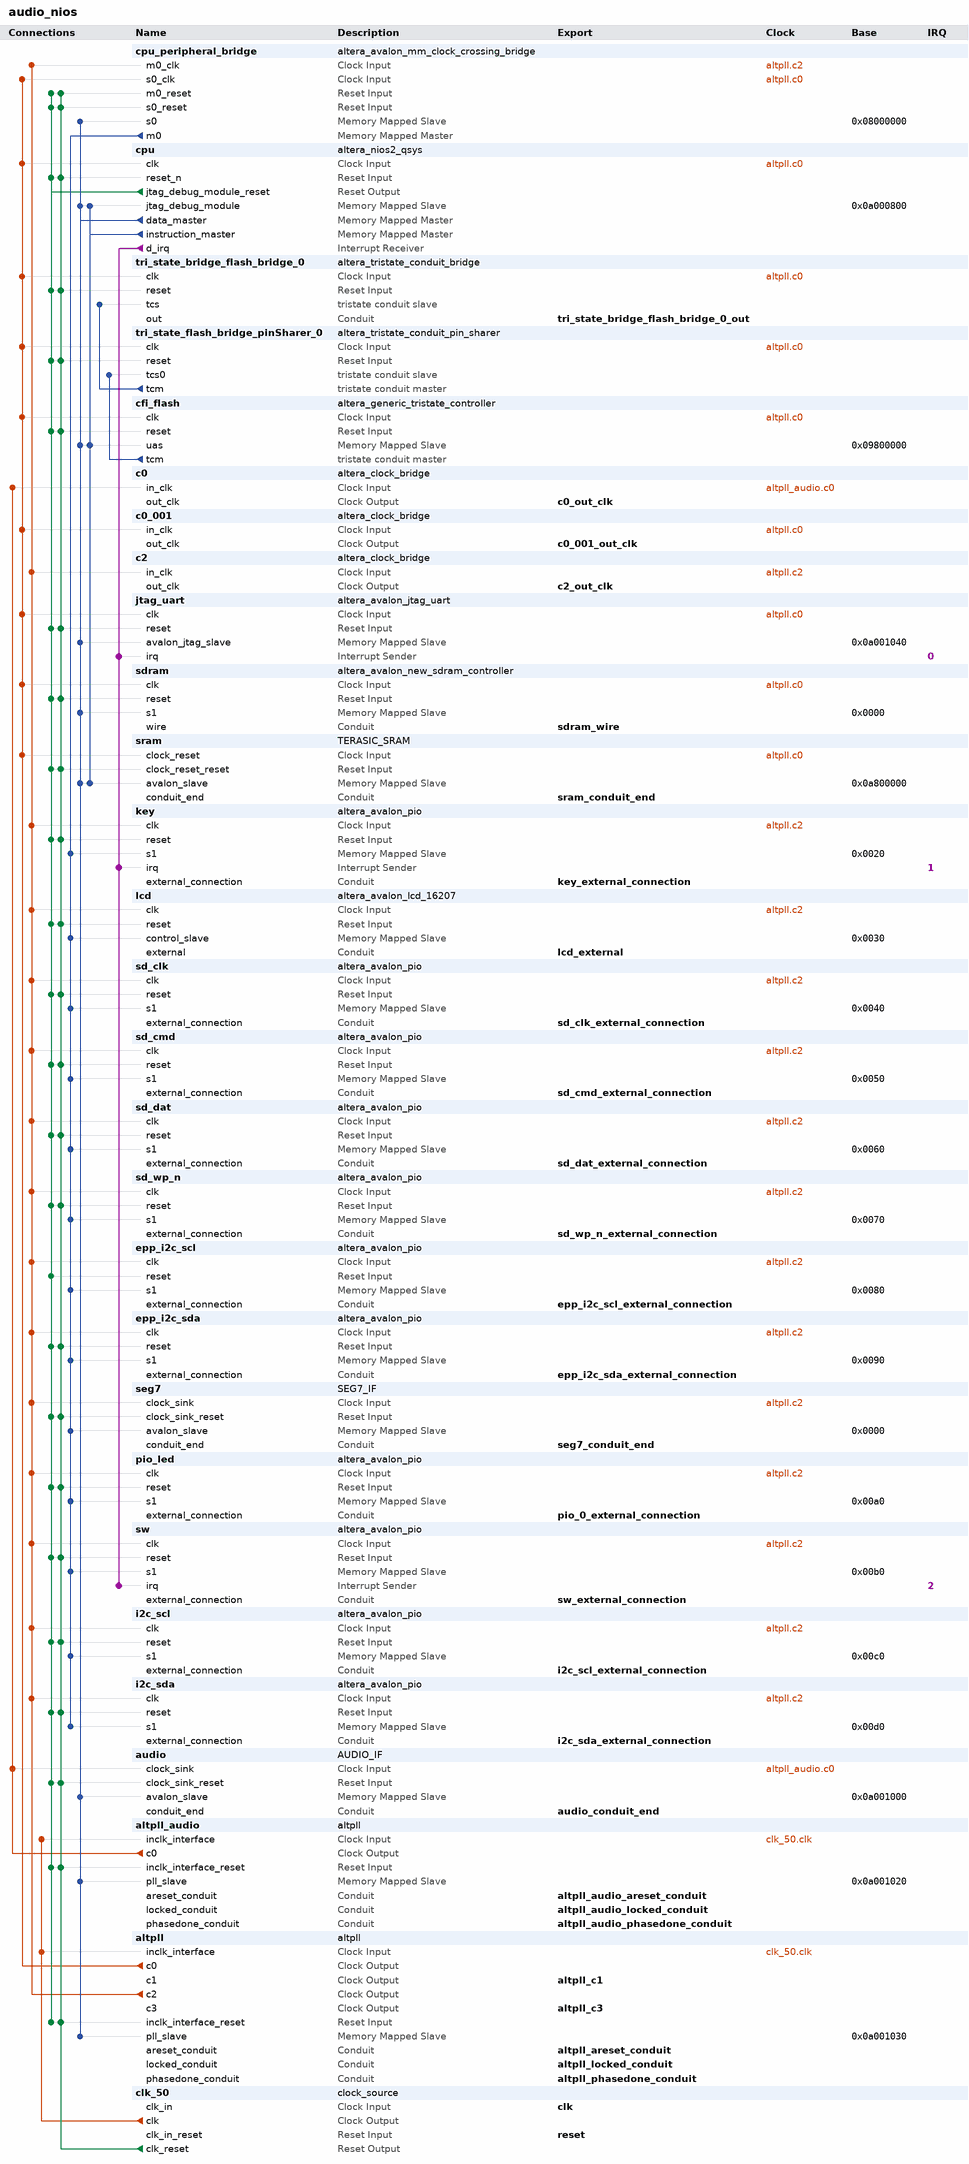
[diagram p0: system contents]
# Platform Designer (Qsys) system audio_nios, Cyclone IV E EP4CE115F29C7
# Parameters at their usual value, and those the tool derives, are not listed.
package require -exact qsys 12.0
create_system audio_nios
set_project_property DEVICE_FAMILY {Cyclone IV E}
set_project_property DEVICE EP4CE115F29C7

add_instance cpu_peripheral_bridge altera_avalon_mm_clock_crossing_bridge 12.0
set_instance_parameter_value cpu_peripheral_bridge DATA_WIDTH 32
set_instance_parameter_value cpu_peripheral_bridge ADDRESS_WIDTH 9
set_instance_parameter_value cpu_peripheral_bridge MAX_BURST_SIZE 1
set_instance_parameter_value cpu_peripheral_bridge COMMAND_FIFO_DEPTH 32
set_instance_parameter_value cpu_peripheral_bridge RESPONSE_FIFO_DEPTH 64
set_instance_parameter_value cpu_peripheral_bridge MASTER_SYNC_DEPTH 3
set_instance_parameter_value cpu_peripheral_bridge SLAVE_SYNC_DEPTH 3

add_instance cpu altera_nios2_qsys 12.0
set_instance_parameter_value cpu resetSlave sram.avalon_slave
set_instance_parameter_value cpu exceptionSlave sram.avalon_slave
set_instance_parameter_value cpu breakSlave cpu.jtag_debug_module
set_instance_parameter_value cpu impl Fast
set_instance_parameter_value cpu icache_size 4096

add_instance tri_state_bridge_flash_bridge_0 altera_tristate_conduit_bridge 12.0

add_instance tri_state_flash_bridge_pinSharer_0 altera_tristate_conduit_pin_sharer 12.0
set_instance_parameter_value tri_state_flash_bridge_pinSharer_0 NUM_INTERFACES 1
set_instance_parameter_value tri_state_flash_bridge_pinSharer_0 MODULE_ORIGIN_LIST cfi_flash.tcm,cfi_flash.tcm,cfi_flash.tcm,cfi_flash.tcm,cfi_flash.tcm
set_instance_parameter_value tri_state_flash_bridge_pinSharer_0 SHARED_SIGNAL_LIST address_to_the_cfi_flash,read_n_to_the_cfi_flash,write_n_to_the_cfi_flash,tri_state_bridge_flash_data,select_n_to_the_cfi_flash

add_instance cfi_flash altera_generic_tristate_controller 12.0
set_instance_parameter_value cfi_flash TCM_ADDRESS_W 23
set_instance_parameter_value cfi_flash TCM_DATA_W 8
set_instance_parameter_value cfi_flash TCM_BYTEENABLE_W 1
set_instance_parameter_value cfi_flash TCM_READ_WAIT 0
set_instance_parameter_value cfi_flash TCM_WRITE_WAIT 0
set_instance_parameter_value cfi_flash TCM_SETUP_WAIT 0
set_instance_parameter_value cfi_flash TCM_DATA_HOLD 0
set_instance_parameter_value cfi_flash TCM_MAX_PENDING_READ_TRANSACTIONS 3
set_instance_parameter_value cfi_flash TCM_TURNAROUND_TIME 2
set_instance_parameter_value cfi_flash TCM_TIMING_UNITS 0
set_instance_parameter_value cfi_flash TCM_READLATENCY 2
set_instance_parameter_value cfi_flash TCM_SYMBOLS_PER_WORD 1
set_instance_parameter_value cfi_flash USE_READ 1
set_instance_parameter_value cfi_flash USE_BEGINTRANSFER 0
set_instance_parameter_value cfi_flash USE_BYTEENABLE 0
set_instance_parameter_value cfi_flash USE_OUTPUTENABLE 0
set_instance_parameter_value cfi_flash ACTIVE_LOW_READ 1
set_instance_parameter_value cfi_flash ACTIVE_LOW_BYTEENABLE 0
set_instance_parameter_value cfi_flash ACTIVE_LOW_OUTPUTENABLE 0
set_instance_parameter_value cfi_flash ACTIVE_LOW_BEGINTRANSFER 0
set_instance_parameter_value cfi_flash CHIPSELECT_THROUGH_READLATENCY 0
set_instance_parameter_value cfi_flash MODULE_ASSIGNMENT_KEYS embeddedsw.configuration.hwClassnameDriverSupportList,embeddedsw.configuration.hwClassnameDriverSupportDefault,embeddedsw.CMacro.SETUP_VALUE,embeddedsw.CMacro.WAIT_VALUE,embeddedsw.CMacro.HOLD_VALUE,embeddedsw.CMacro.TIMING_UNITS,embeddedsw.CMacro.SIZE,embeddedsw.memoryInfo.MEM_INIT_DATA_WIDTH,embeddedsw.memoryInfo.HAS_BYTE_LANE,embeddedsw.memoryInfo.IS_FLASH,embeddedsw.memoryInfo.GENERATE_DAT_SYM,embeddedsw.memoryInfo.GENERATE_FLASH,embeddedsw.memoryInfo.DAT_SYM_INSTALL_DIR,embeddedsw.memoryInfo.FLASH_INSTALL_DIR
set_instance_parameter_value cfi_flash MODULE_ASSIGNMENT_VALUES altera_avalon_lan91c111:altera_avalon_cfi_flash,altera_avalon_cfi_flash,60,160,60,ns,8388608u,8,0,1,1,1,SIM_DIR,APP_DIR
set_instance_parameter_value cfi_flash INTERFACE_ASSIGNMENT_KEYS embeddedsw.configuration.isFlash,embeddedsw.configuration.isMemoryDevice,embeddedsw.configuration.isNonVolatileStorage
set_instance_parameter_value cfi_flash INTERFACE_ASSIGNMENT_VALUES 1,1,1

add_instance c0 altera_clock_bridge 12.0
set_instance_parameter_value c0 DERIVED_CLOCK_RATE 18431999
set_instance_parameter_value c0 EXPLICIT_CLOCK_RATE 0

add_instance c0_001 altera_clock_bridge 12.0
set_instance_parameter_value c0_001 DERIVED_CLOCK_RATE 100000000
set_instance_parameter_value c0_001 EXPLICIT_CLOCK_RATE 0

add_instance c2 altera_clock_bridge 12.0
set_instance_parameter_value c2 DERIVED_CLOCK_RATE 10000000
set_instance_parameter_value c2 EXPLICIT_CLOCK_RATE 0

add_instance jtag_uart altera_avalon_jtag_uart 12.0
set_instance_parameter_value jtag_uart simInteractiveOptions INTERACTIVE_ASCII_OUTPUT

add_instance sdram altera_avalon_new_sdram_controller 12.0
set_instance_parameter_value sdram TAC 6.0
set_instance_parameter_value sdram TRCD 20.0
set_instance_parameter_value sdram TRP 20.0
set_instance_parameter_value sdram casLatency 3
set_instance_parameter_value sdram columnWidth 10
set_instance_parameter_value sdram dataWidth 32
set_instance_parameter_value sdram generateSimulationModel true
set_instance_parameter_value sdram model custom
set_instance_parameter_value sdram numberOfBanks 4
set_instance_parameter_value sdram numberOfChipSelects 1
set_instance_parameter_value sdram powerUpDelay 100.0
set_instance_parameter_value sdram refreshPeriod 15.625
set_instance_parameter_value sdram rowWidth 13

add_instance sram TERASIC_SRAM 1.0
set_instance_parameter_value sram DATA_BITS 16
set_instance_parameter_value sram ADDR_BITS 20

add_instance key altera_avalon_pio 12.0
set_instance_parameter_value key captureEdge true
set_instance_parameter_value key direction Input
set_instance_parameter_value key edgeType FALLING
set_instance_parameter_value key generateIRQ true
set_instance_parameter_value key irqType EDGE
set_instance_parameter_value key width 4

add_instance lcd altera_avalon_lcd_16207 12.0

add_instance sd_clk altera_avalon_pio 12.0
set_instance_parameter_value sd_clk direction Output
set_instance_parameter_value sd_clk width 1

add_instance sd_cmd altera_avalon_pio 12.0
set_instance_parameter_value sd_cmd direction Bidir
set_instance_parameter_value sd_cmd width 1

add_instance sd_dat altera_avalon_pio 12.0
set_instance_parameter_value sd_dat direction Bidir
set_instance_parameter_value sd_dat width 4

add_instance sd_wp_n altera_avalon_pio 12.0
set_instance_parameter_value sd_wp_n direction Input
set_instance_parameter_value sd_wp_n width 1

add_instance epp_i2c_scl altera_avalon_pio 12.0
set_instance_parameter_value epp_i2c_scl direction Output
set_instance_parameter_value epp_i2c_scl width 1

add_instance epp_i2c_sda altera_avalon_pio 12.0
set_instance_parameter_value epp_i2c_sda direction Bidir
set_instance_parameter_value epp_i2c_sda width 1

add_instance seg7 SEG7_IF 1.0
set_instance_parameter_value seg7 SEG7_NUM 8

add_instance pio_led altera_avalon_pio 12.0
set_instance_parameter_value pio_led direction Output
set_instance_parameter_value pio_led width 26

add_instance sw altera_avalon_pio 12.0
set_instance_parameter_value sw captureEdge true
set_instance_parameter_value sw direction Input
set_instance_parameter_value sw edgeType FALLING
set_instance_parameter_value sw generateIRQ true
set_instance_parameter_value sw irqType EDGE
set_instance_parameter_value sw width 18

add_instance i2c_scl altera_avalon_pio 12.0
set_instance_parameter_value i2c_scl direction Output
set_instance_parameter_value i2c_scl width 1

add_instance i2c_sda altera_avalon_pio 12.0
set_instance_parameter_value i2c_sda direction Bidir
set_instance_parameter_value i2c_sda width 1

add_instance audio AUDIO_IF 1.0

add_instance altpll_audio altpll 12.0
set_instance_parameter_value altpll_audio INCLK0_INPUT_FREQUENCY 20000
set_instance_parameter_value altpll_audio CLK0_MULTIPLY_BY 1152
set_instance_parameter_value altpll_audio CLK0_DIVIDE_BY 3125
set_instance_parameter_value altpll_audio PORT_clk1 PORT_UNUSED
set_instance_parameter_value altpll_audio PORT_clk2 PORT_UNUSED
set_instance_parameter_value altpll_audio PORT_clk3 PORT_UNUSED
set_instance_parameter_value altpll_audio PORT_ARESET PORT_UNUSED
set_instance_parameter_value altpll_audio PORT_LOCKED PORT_UNUSED

add_instance altpll altpll 12.0
set_instance_parameter_value altpll INCLK0_INPUT_FREQUENCY 20000
set_instance_parameter_value altpll CLK0_MULTIPLY_BY 2
set_instance_parameter_value altpll CLK1_MULTIPLY_BY 2
set_instance_parameter_value altpll CLK2_MULTIPLY_BY 1
set_instance_parameter_value altpll CLK3_MULTIPLY_BY 1
set_instance_parameter_value altpll CLK0_DIVIDE_BY 1
set_instance_parameter_value altpll CLK1_DIVIDE_BY 1
set_instance_parameter_value altpll CLK2_DIVIDE_BY 5
set_instance_parameter_value altpll CLK3_DIVIDE_BY 2
set_instance_parameter_value altpll CLK1_PHASE_SHIFT -1806
set_instance_parameter_value altpll CLK2_PHASE_SHIFT 0
set_instance_parameter_value altpll CLK3_PHASE_SHIFT 0
set_instance_parameter_value altpll CLK1_DUTY_CYCLE 50
set_instance_parameter_value altpll CLK2_DUTY_CYCLE 50
set_instance_parameter_value altpll CLK3_DUTY_CYCLE 50
set_instance_parameter_value altpll PORT_clk1 PORT_USED
set_instance_parameter_value altpll PORT_clk2 PORT_USED
set_instance_parameter_value altpll PORT_clk3 PORT_USED
set_instance_parameter_value altpll PORT_ARESET PORT_UNUSED
set_instance_parameter_value altpll PORT_LOCKED PORT_UNUSED

add_instance clk_50 clock_source 12.0
set_instance_parameter_value clk_50 clockFrequency 50000000

# connections
add_connection altpll.c0 c0_001.in_clk clock
add_connection altpll.c0 cfi_flash.clk clock
add_connection altpll.c0 cpu.clk clock
add_connection altpll.c0 cpu_peripheral_bridge.s0_clk clock
add_connection altpll.c0 jtag_uart.clk clock
add_connection altpll.c0 sdram.clk clock
add_connection altpll.c0 sram.clock_reset clock
add_connection altpll.c0 tri_state_bridge_flash_bridge_0.clk clock
add_connection altpll.c0 tri_state_flash_bridge_pinSharer_0.clk clock
add_connection altpll.c2 c2.in_clk clock
add_connection altpll.c2 cpu_peripheral_bridge.m0_clk clock
add_connection altpll.c2 epp_i2c_scl.clk clock
add_connection altpll.c2 epp_i2c_sda.clk clock
add_connection altpll.c2 i2c_scl.clk clock
add_connection altpll.c2 i2c_sda.clk clock
add_connection altpll.c2 key.clk clock
add_connection altpll.c2 lcd.clk clock
add_connection altpll.c2 pio_led.clk clock
add_connection altpll.c2 sd_clk.clk clock
add_connection altpll.c2 sd_cmd.clk clock
add_connection altpll.c2 sd_dat.clk clock
add_connection altpll.c2 sd_wp_n.clk clock
add_connection altpll.c2 seg7.clock_sink clock
add_connection altpll.c2 sw.clk clock
add_connection altpll_audio.c0 audio.clock_sink clock
add_connection altpll_audio.c0 c0.in_clk clock
add_connection clk_50.clk altpll.inclk_interface clock
add_connection clk_50.clk altpll_audio.inclk_interface clock
add_connection clk_50.clk_reset altpll.inclk_interface_reset reset
add_connection clk_50.clk_reset altpll_audio.inclk_interface_reset reset
add_connection clk_50.clk_reset audio.clock_sink_reset reset
add_connection clk_50.clk_reset cfi_flash.reset reset
add_connection clk_50.clk_reset cpu.reset_n reset
add_connection clk_50.clk_reset cpu_peripheral_bridge.m0_reset reset
add_connection clk_50.clk_reset cpu_peripheral_bridge.s0_reset reset
add_connection clk_50.clk_reset epp_i2c_sda.reset reset
add_connection clk_50.clk_reset i2c_scl.reset reset
add_connection clk_50.clk_reset i2c_sda.reset reset
add_connection clk_50.clk_reset jtag_uart.reset reset
add_connection clk_50.clk_reset key.reset reset
add_connection clk_50.clk_reset lcd.reset reset
add_connection clk_50.clk_reset pio_led.reset reset
add_connection clk_50.clk_reset sd_clk.reset reset
add_connection clk_50.clk_reset sd_cmd.reset reset
add_connection clk_50.clk_reset sd_dat.reset reset
add_connection clk_50.clk_reset sd_wp_n.reset reset
add_connection clk_50.clk_reset sdram.reset reset
add_connection clk_50.clk_reset seg7.clock_sink_reset reset
add_connection clk_50.clk_reset sram.clock_reset_reset reset
add_connection clk_50.clk_reset sw.reset reset
add_connection clk_50.clk_reset tri_state_bridge_flash_bridge_0.reset reset
add_connection clk_50.clk_reset tri_state_flash_bridge_pinSharer_0.reset reset
add_connection cpu.jtag_debug_module_reset altpll.inclk_interface_reset reset
add_connection cpu.jtag_debug_module_reset altpll_audio.inclk_interface_reset reset
add_connection cpu.jtag_debug_module_reset audio.clock_sink_reset reset
add_connection cpu.jtag_debug_module_reset cfi_flash.reset reset
add_connection cpu.jtag_debug_module_reset cpu.reset_n reset
add_connection cpu.jtag_debug_module_reset cpu_peripheral_bridge.m0_reset reset
add_connection cpu.jtag_debug_module_reset cpu_peripheral_bridge.s0_reset reset
add_connection cpu.jtag_debug_module_reset epp_i2c_scl.reset reset
add_connection cpu.jtag_debug_module_reset epp_i2c_sda.reset reset
add_connection cpu.jtag_debug_module_reset i2c_scl.reset reset
add_connection cpu.jtag_debug_module_reset i2c_sda.reset reset
add_connection cpu.jtag_debug_module_reset jtag_uart.reset reset
add_connection cpu.jtag_debug_module_reset key.reset reset
add_connection cpu.jtag_debug_module_reset lcd.reset reset
add_connection cpu.jtag_debug_module_reset pio_led.reset reset
add_connection cpu.jtag_debug_module_reset sd_clk.reset reset
add_connection cpu.jtag_debug_module_reset sd_cmd.reset reset
add_connection cpu.jtag_debug_module_reset sd_dat.reset reset
add_connection cpu.jtag_debug_module_reset sd_wp_n.reset reset
add_connection cpu.jtag_debug_module_reset sdram.reset reset
add_connection cpu.jtag_debug_module_reset seg7.clock_sink_reset reset
add_connection cpu.jtag_debug_module_reset sram.clock_reset_reset reset
add_connection cpu.jtag_debug_module_reset sw.reset reset
add_connection cpu.jtag_debug_module_reset tri_state_bridge_flash_bridge_0.reset reset
add_connection cpu.jtag_debug_module_reset tri_state_flash_bridge_pinSharer_0.reset reset
add_connection cpu.data_master altpll.pll_slave avalon
set_connection_parameter_value cpu.data_master/altpll.pll_slave baseAddress 0x0a001030
add_connection cpu.data_master altpll_audio.pll_slave avalon
set_connection_parameter_value cpu.data_master/altpll_audio.pll_slave baseAddress 0x0a001020
add_connection cpu.data_master audio.avalon_slave avalon
set_connection_parameter_value cpu.data_master/audio.avalon_slave baseAddress 0x0a001000
add_connection cpu.data_master cfi_flash.uas avalon
set_connection_parameter_value cpu.data_master/cfi_flash.uas baseAddress 0x09800000
add_connection cpu.data_master cpu.jtag_debug_module avalon
set_connection_parameter_value cpu.data_master/cpu.jtag_debug_module baseAddress 0x0a000800
add_connection cpu.data_master cpu_peripheral_bridge.s0 avalon
set_connection_parameter_value cpu.data_master/cpu_peripheral_bridge.s0 baseAddress 0x08000000
add_connection cpu.data_master jtag_uart.avalon_jtag_slave avalon
set_connection_parameter_value cpu.data_master/jtag_uart.avalon_jtag_slave baseAddress 0x0a001040
add_connection cpu.data_master sdram.s1 avalon
set_connection_parameter_value cpu.data_master/sdram.s1 baseAddress 0x0000
add_connection cpu.data_master sram.avalon_slave avalon
set_connection_parameter_value cpu.data_master/sram.avalon_slave baseAddress 0x0a800000
add_connection cpu.instruction_master cfi_flash.uas avalon
set_connection_parameter_value cpu.instruction_master/cfi_flash.uas baseAddress 0x09800000
add_connection cpu.instruction_master cpu.jtag_debug_module avalon
set_connection_parameter_value cpu.instruction_master/cpu.jtag_debug_module baseAddress 0x0a000800
add_connection cpu.instruction_master sram.avalon_slave avalon
set_connection_parameter_value cpu.instruction_master/sram.avalon_slave baseAddress 0x0a800000
add_connection cpu_peripheral_bridge.m0 epp_i2c_scl.s1 avalon
set_connection_parameter_value cpu_peripheral_bridge.m0/epp_i2c_scl.s1 baseAddress 0x0080
add_connection cpu_peripheral_bridge.m0 epp_i2c_sda.s1 avalon
set_connection_parameter_value cpu_peripheral_bridge.m0/epp_i2c_sda.s1 baseAddress 0x0090
add_connection cpu_peripheral_bridge.m0 i2c_scl.s1 avalon
set_connection_parameter_value cpu_peripheral_bridge.m0/i2c_scl.s1 baseAddress 0x00c0
add_connection cpu_peripheral_bridge.m0 i2c_sda.s1 avalon
set_connection_parameter_value cpu_peripheral_bridge.m0/i2c_sda.s1 baseAddress 0x00d0
add_connection cpu_peripheral_bridge.m0 key.s1 avalon
set_connection_parameter_value cpu_peripheral_bridge.m0/key.s1 baseAddress 0x0020
add_connection cpu_peripheral_bridge.m0 lcd.control_slave avalon
set_connection_parameter_value cpu_peripheral_bridge.m0/lcd.control_slave baseAddress 0x0030
add_connection cpu_peripheral_bridge.m0 pio_led.s1 avalon
set_connection_parameter_value cpu_peripheral_bridge.m0/pio_led.s1 baseAddress 0x00a0
add_connection cpu_peripheral_bridge.m0 sd_clk.s1 avalon
set_connection_parameter_value cpu_peripheral_bridge.m0/sd_clk.s1 baseAddress 0x0040
add_connection cpu_peripheral_bridge.m0 sd_cmd.s1 avalon
set_connection_parameter_value cpu_peripheral_bridge.m0/sd_cmd.s1 baseAddress 0x0050
add_connection cpu_peripheral_bridge.m0 sd_dat.s1 avalon
set_connection_parameter_value cpu_peripheral_bridge.m0/sd_dat.s1 baseAddress 0x0060
add_connection cpu_peripheral_bridge.m0 sd_wp_n.s1 avalon
set_connection_parameter_value cpu_peripheral_bridge.m0/sd_wp_n.s1 baseAddress 0x0070
add_connection cpu_peripheral_bridge.m0 seg7.avalon_slave avalon
set_connection_parameter_value cpu_peripheral_bridge.m0/seg7.avalon_slave baseAddress 0x0000
add_connection cpu_peripheral_bridge.m0 sw.s1 avalon
set_connection_parameter_value cpu_peripheral_bridge.m0/sw.s1 baseAddress 0x00b0
add_connection cpu.d_irq jtag_uart.irq interrupt
set_connection_parameter_value cpu.d_irq/jtag_uart.irq irqNumber 0
add_connection cpu.d_irq key.irq interrupt
set_connection_parameter_value cpu.d_irq/key.irq irqNumber 1
add_connection cpu.d_irq sw.irq interrupt
set_connection_parameter_value cpu.d_irq/sw.irq irqNumber 2
add_connection cfi_flash.tcm tri_state_flash_bridge_pinSharer_0.tcs0 tristate_conduit
add_connection tri_state_flash_bridge_pinSharer_0.tcm tri_state_bridge_flash_bridge_0.tcs tristate_conduit

# exported interfaces
add_interface tri_state_bridge_flash_bridge_0_out conduit end
set_interface_property tri_state_bridge_flash_bridge_0_out EXPORT_OF tri_state_bridge_flash_bridge_0.out
add_interface c0_out_clk clock source
set_interface_property c0_out_clk EXPORT_OF c0.out_clk
add_interface c0_001_out_clk clock source
set_interface_property c0_001_out_clk EXPORT_OF c0_001.out_clk
add_interface c2_out_clk clock source
set_interface_property c2_out_clk EXPORT_OF c2.out_clk
add_interface sram_conduit_end conduit end
set_interface_property sram_conduit_end EXPORT_OF sram.conduit_end
add_interface key_external_connection conduit end
set_interface_property key_external_connection EXPORT_OF key.external_connection
add_interface lcd_external conduit end
set_interface_property lcd_external EXPORT_OF lcd.external
add_interface sd_clk_external_connection conduit end
set_interface_property sd_clk_external_connection EXPORT_OF sd_clk.external_connection
add_interface sd_cmd_external_connection conduit end
set_interface_property sd_cmd_external_connection EXPORT_OF sd_cmd.external_connection
add_interface sd_dat_external_connection conduit end
set_interface_property sd_dat_external_connection EXPORT_OF sd_dat.external_connection
add_interface sd_wp_n_external_connection conduit end
set_interface_property sd_wp_n_external_connection EXPORT_OF sd_wp_n.external_connection
add_interface epp_i2c_scl_external_connection conduit end
set_interface_property epp_i2c_scl_external_connection EXPORT_OF epp_i2c_scl.external_connection
add_interface epp_i2c_sda_external_connection conduit end
set_interface_property epp_i2c_sda_external_connection EXPORT_OF epp_i2c_sda.external_connection
add_interface seg7_conduit_end conduit end
set_interface_property seg7_conduit_end EXPORT_OF seg7.conduit_end
add_interface pio_0_external_connection conduit end
set_interface_property pio_0_external_connection EXPORT_OF pio_led.external_connection
add_interface sw_external_connection conduit end
set_interface_property sw_external_connection EXPORT_OF sw.external_connection
add_interface i2c_scl_external_connection conduit end
set_interface_property i2c_scl_external_connection EXPORT_OF i2c_scl.external_connection
add_interface i2c_sda_external_connection conduit end
set_interface_property i2c_sda_external_connection EXPORT_OF i2c_sda.external_connection
add_interface audio_conduit_end conduit end
set_interface_property audio_conduit_end EXPORT_OF audio.conduit_end
add_interface altpll_audio_areset_conduit conduit end
set_interface_property altpll_audio_areset_conduit EXPORT_OF altpll_audio.areset_conduit
add_interface altpll_audio_locked_conduit conduit end
set_interface_property altpll_audio_locked_conduit EXPORT_OF altpll_audio.locked_conduit
add_interface altpll_audio_phasedone_conduit conduit end
set_interface_property altpll_audio_phasedone_conduit EXPORT_OF altpll_audio.phasedone_conduit
add_interface clk clock sink
set_interface_property clk EXPORT_OF clk_50.clk_in
add_interface reset reset sink
set_interface_property reset EXPORT_OF clk_50.clk_in_reset
add_interface sdram_wire conduit end
set_interface_property sdram_wire EXPORT_OF sdram.wire
add_interface altpll_c3 clock source
set_interface_property altpll_c3 EXPORT_OF altpll.c3
add_interface altpll_areset_conduit conduit end
set_interface_property altpll_areset_conduit EXPORT_OF altpll.areset_conduit
add_interface altpll_locked_conduit conduit end
set_interface_property altpll_locked_conduit EXPORT_OF altpll.locked_conduit
add_interface altpll_phasedone_conduit conduit end
set_interface_property altpll_phasedone_conduit EXPORT_OF altpll.phasedone_conduit
add_interface altpll_c1 clock source
set_interface_property altpll_c1 EXPORT_OF altpll.c1

save_system audio_nios.qsys
